# EasyEDA schematic SCH_FINAL.json
TITLE: Sheet_1; REV: 1.0; Date: 2023-05-06; Sheet: 1/1; Drawn By: supunchira; Company: Your Company
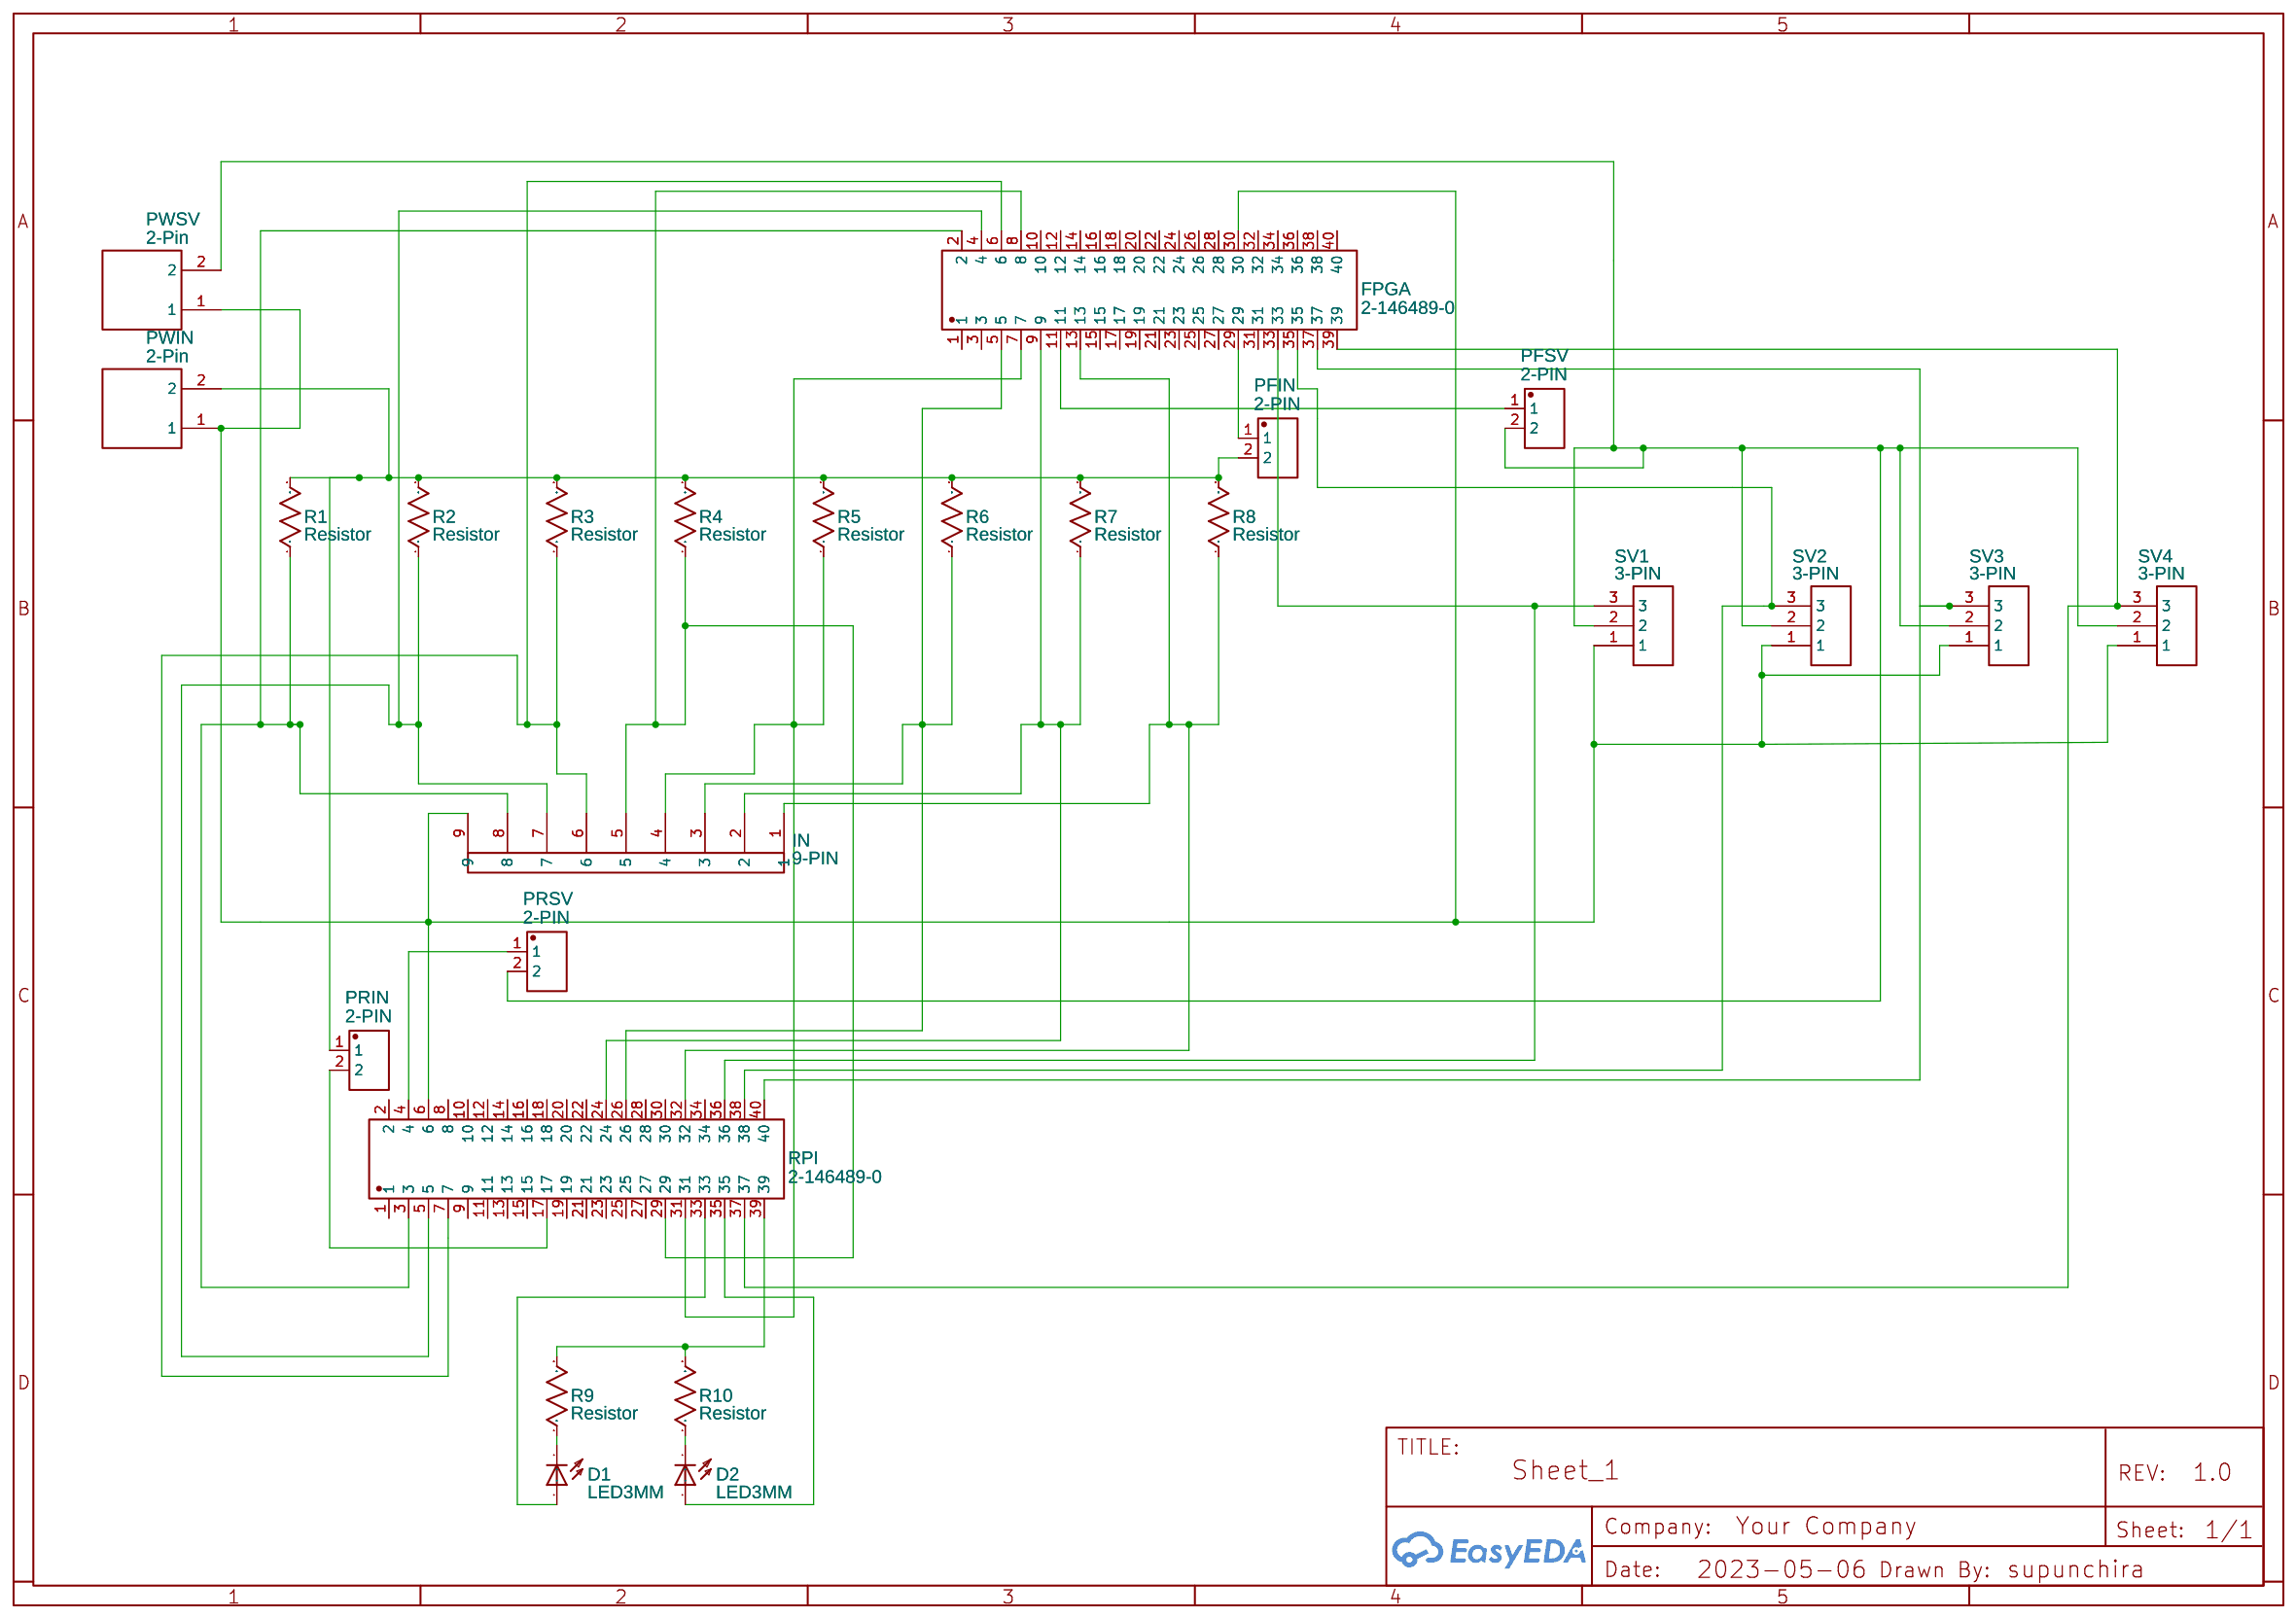
[diagram p0: schematic sheet]

## Parts
D1  LED3MM  [LED3MM]
D2  LED3MM  [LED3MM]
FPGA  2-146489-0  [HDR-TH_40P-P2.54-V-M-R2-C20-S2.54-2]
IN  9-PIN  [HEADER]
PFIN  2-PIN  [2-PIN-MALE-CONNECTOR]
PFSV  2-PIN  [2-PIN-MALE-CONNECTOR]
PRIN  2-PIN  [2-PIN-MALE-CONNECTOR]
PRSV  2-PIN  [2-PIN-MALE-CONNECTOR]
PWIN  2-Pin  [2-PIN-MALE-HEADER-2.54MM]
PWSV  2-Pin  [2-PIN-MALE-HEADER-2.54MM]
R1  Resistor  [RESISTOR]
R2  Resistor  [RESISTOR]
R3  Resistor  [RESISTOR]
R4  Resistor  [RESISTOR]
R5  Resistor  [RESISTOR]
R6  Resistor  [RESISTOR]
R7  Resistor  [RESISTOR]
R8  Resistor  [RESISTOR]
R9  Resistor  [RESISTOR]
R10  Resistor  [RESISTOR]
RPI  2-146489-0  [HDR-TH_40P-P2.54-V-M-R2-C20-S2.54-2]
SV1  3-PIN  [3-PIN 2.54]
SV2  3-PIN  [3-PIN 2.54]
SV3  3-PIN  [3-PIN 2.54]
SV4  3-PIN  [3-PIN 2.54]

## Library data of the parts
D1 D2 = LED3MM: Contributor: discoverer
FPGA RPI = 2-146489-0: Supplier: LCSC; Supplier Part: C3334839; Manufacturer: TE Connectivity(美国泰科); Contributor: lcsc
IN = Header9Pin: Contributor: DickNannar
PFIN PFSV PRIN PRSV = 2-PIN-MALE-CONNECTOR COPY: Supplier Part: C23595; Supplier: LCSC; Manufacturer: ReliaPro; Manufacturer Part: Terminals/WJ2EDGV-5.08-8P; image: //image.lceda.cn/szlcsc/C23595.jpg; Contributor: ilmanciobo
PWIN PWSV = 2-Pin-Male-Header-2.54mm: Contributor: zynctank
R1-R10 = Resistor: Contributor: kevinjohnson27
SV1-SV4 = 3-PIN: Contributor: felipecavallini11

## Nets
Net-(D1-A): D1.A RPI.33
Net-(D1-K): D1.K(C) R9.1(P1)
Net-(D2-A): D2.A RPI.35
Net-(D2-K): D2.K(C) R10.1(P1)
Net-(FPGA-2): FPGA.2 IN.8 R1.1(P1) RPI.3
Net-(FPGA-4): FPGA.4 IN.7 R2.1(P1) RPI.5
Net-(FPGA-5): FPGA.5 IN.3 R6.1(P1) RPI.26
Net-(FPGA-6): FPGA.6 IN.6 R3.1(P1) RPI.7
Net-(FPGA-7): FPGA.7 IN.4 R5.1(P1) RPI.31
Net-(FPGA-8): FPGA.8 IN.5 R4.1(P1) RPI.29
Net-(FPGA-9): FPGA.9 IN.2 R7.1(P1) RPI.24
Net-(FPGA-11): FPGA.11 PFSV.1
Net-(FPGA-13): FPGA.13 IN.1 R8.1(P1) RPI.32
Net-(FPGA-29): FPGA.29 PFIN.1
Net-(FPGA-30): FPGA.30 IN.9 PWIN.1 PWSV.1 RPI.6 SV1.1 SV2.1 SV3.1 SV4.1
Net-(FPGA-33): FPGA.33 RPI.36 SV1.3
Net-(FPGA-35): FPGA.35 RPI.38 SV2.3
Net-(FPGA-37): FPGA.37 RPI.40 SV3.3
Net-(FPGA-39): FPGA.39 RPI.37 SV4.3
Net-(PFIN-2): PFIN.2 PRIN.1 PWIN.2 R1.2(P2) R2.2(P2) R3.2(P2) R4.2(P2) R5.2(P2) R6.2(P2) R7.2(P2) R8.2(P2)
Net-(PFSV-2): PFSV.2 PRSV.2 PWSV.2 SV1.2 SV2.2 SV3.2 SV4.2
Net-(PRIN-2): PRIN.2 RPI.17
Net-(PRSV-1): PRSV.1 RPI.4
Net-(R9-2): R9.2(P2) R10.2(P2) RPI.39

Not connected (* = marked no-connect by the designer): FPGA 1 3 10 12 14 15 16 17 18 19 20 21 22 23 24 25 26 27 28 31 32 34 36 38 40; RPI 1 2 8 9 10 11 12 13 14 15 16 18 19 20 21 22 23 25 27 28 30 34
